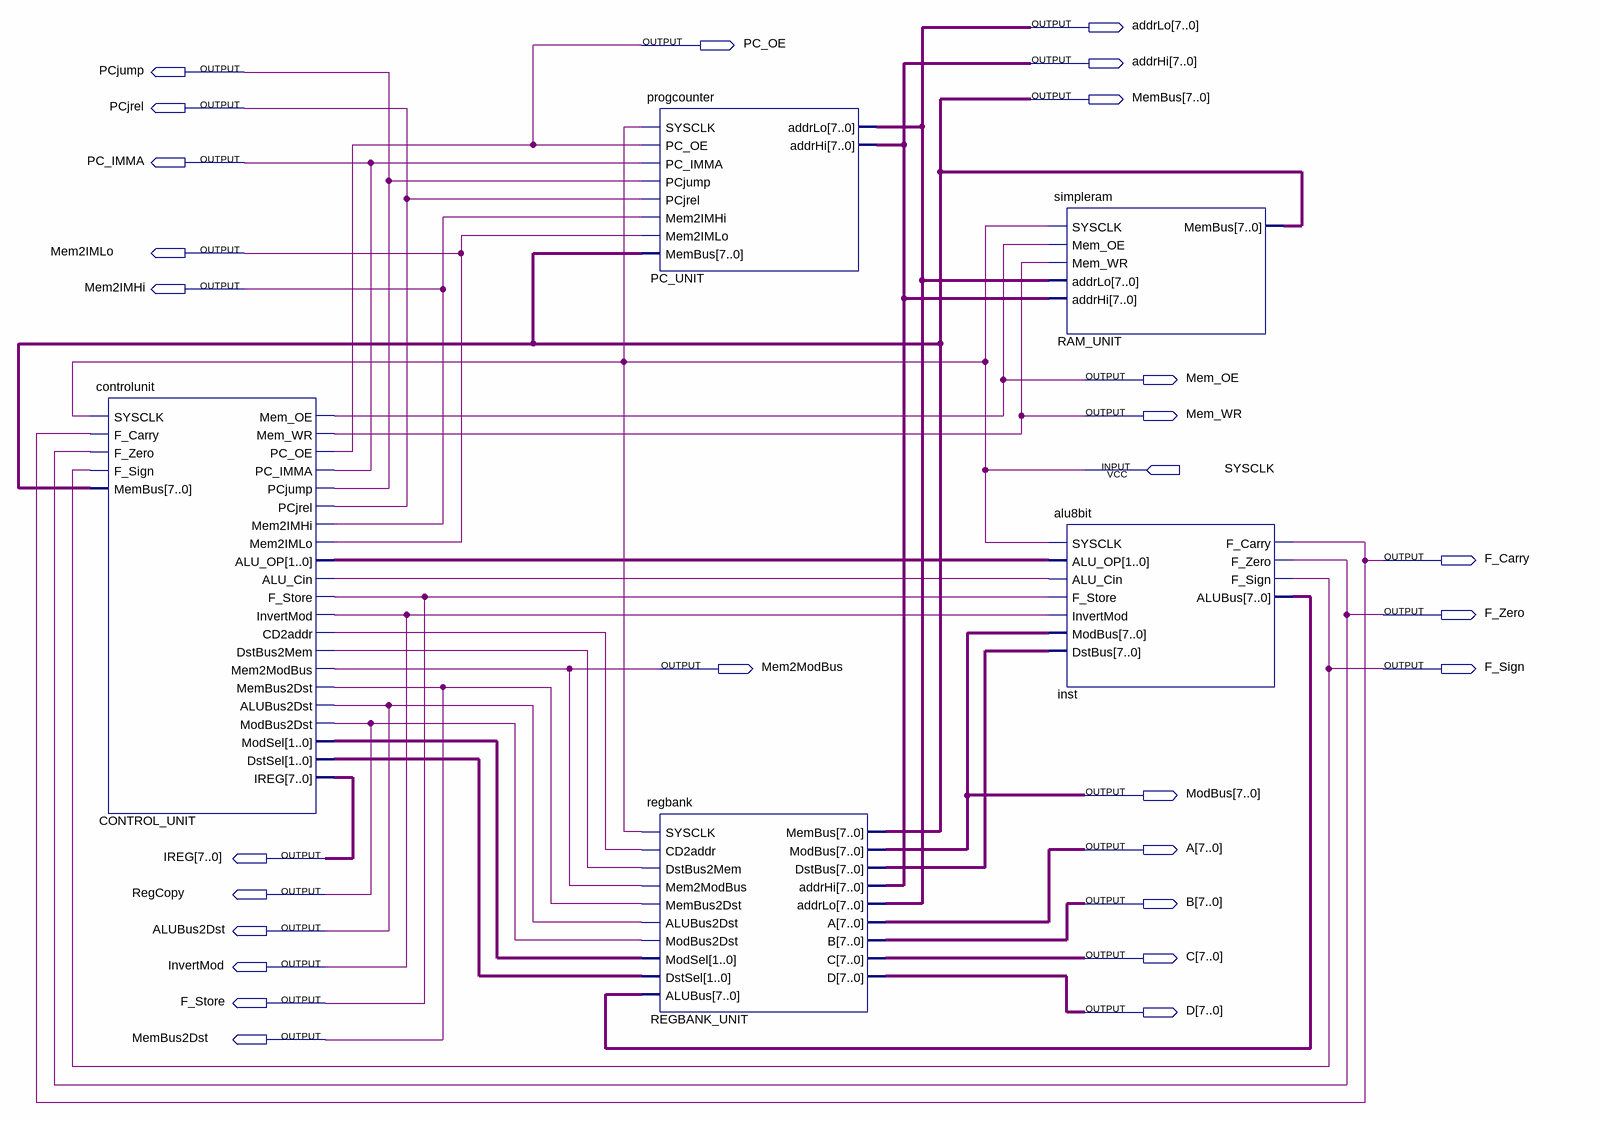
[diagram p0: schematic sheet]
// Quartus schematic rev3core.bdf as structural Verilog: 5 symbols, 27 pins
module rev3core (
  input  SYSCLK,
  output [7:0] addrLo,
  output PC_OE,
  output [7:0] addrHi,
  output PCjump,
  output [7:0] MemBus,
  output PCjrel,
  output PC_IMMA,
  output Mem2IMLo,
  output Mem2IMHi,
  output Mem_OE,
  output Mem_WR,
  output F_Carry,
  output F_Zero,
  output Mem2ModBus,
  output F_Sign,
  output [7:0] ModBus,
  output [7:0] A,
  output [7:0] IREG,
  output RegCopy,
  output [7:0] B,
  output ALUBus2Dst,
  output [7:0] C,
  output InvertMod,
  output F_Store,
  output [7:0] D,
  output MemBus2Dst
);

  wire CONTROL_UNIT_alu_cin, CONTROL_UNIT_cd2addr, CONTROL_UNIT_dstbus2mem;
  wire [1:0] CONTROL_UNIT_alu_op, CONTROL_UNIT_dstsel, CONTROL_UNIT_modsel;
  wire [7:0] inst_alubus, REGBANK_UNIT_dstbus;

  controlunit CONTROL_UNIT (
    .SYSCLK(SYSCLK), .F_Carry(F_Carry), .F_Zero(F_Zero), .F_Sign(F_Sign), .MemBus(MemBus), .Mem_OE(Mem_OE),
    .Mem_WR(Mem_WR), .PC_OE(PC_OE), .PC_IMMA(PC_IMMA), .PCjump(PCjump), .PCjrel(PCjrel), .Mem2IMHi(Mem2IMHi),
    .Mem2IMLo(Mem2IMLo), .ALU_OP(CONTROL_UNIT_alu_op), .ALU_Cin(CONTROL_UNIT_alu_cin), .F_Store(F_Store),
    .InvertMod(InvertMod), .CD2addr(CONTROL_UNIT_cd2addr), .DstBus2Mem(CONTROL_UNIT_dstbus2mem),
    .Mem2ModBus(Mem2ModBus), .MemBus2Dst(MemBus2Dst), .ALUBus2Dst(ALUBus2Dst), .ModBus2Dst(RegCopy),
    .ModSel(CONTROL_UNIT_modsel), .DstSel(CONTROL_UNIT_dstsel), .IREG(IREG));
  progcounter PC_UNIT (
    .SYSCLK(SYSCLK), .PC_OE(PC_OE), .PC_IMMA(PC_IMMA), .PCjump(PCjump), .PCjrel(PCjrel), .Mem2IMHi(Mem2IMHi),
    .Mem2IMLo(Mem2IMLo), .MemBus(MemBus), .addrLo(addrLo), .addrHi(addrHi));
  regbank REGBANK_UNIT (
    .SYSCLK(SYSCLK), .CD2addr(CONTROL_UNIT_cd2addr), .DstBus2Mem(CONTROL_UNIT_dstbus2mem),
    .Mem2ModBus(Mem2ModBus), .MemBus2Dst(MemBus2Dst), .ALUBus2Dst(ALUBus2Dst), .ModBus2Dst(RegCopy),
    .ModSel(CONTROL_UNIT_modsel), .DstSel(CONTROL_UNIT_dstsel), .ALUBus(inst_alubus),
    .DstBus(REGBANK_UNIT_dstbus), .addrHi(addrHi), .addrLo(addrLo), .A(A), .B(B), .C(C), .D(D),
    .MemBus(MemBus), .ModBus(ModBus));
  simpleram RAM_UNIT (
    .SYSCLK(SYSCLK), .Mem_OE(Mem_OE), .Mem_WR(Mem_WR), .addrLo(addrLo), .addrHi(addrHi), .MemBus(MemBus));
  alu8bit inst (
    .SYSCLK(SYSCLK), .ALU_OP(CONTROL_UNIT_alu_op), .ALU_Cin(CONTROL_UNIT_alu_cin), .F_Store(F_Store),
    .InvertMod(InvertMod), .ModBus(ModBus), .DstBus(REGBANK_UNIT_dstbus), .F_Carry(F_Carry), .F_Zero(F_Zero),
    .F_Sign(F_Sign), .ALUBus(inst_alubus));
endmodule
